# Altium schematic sheet REF_Sensors.SchDoc
size A4; SheetNumber: 8; SheetTotal: 8
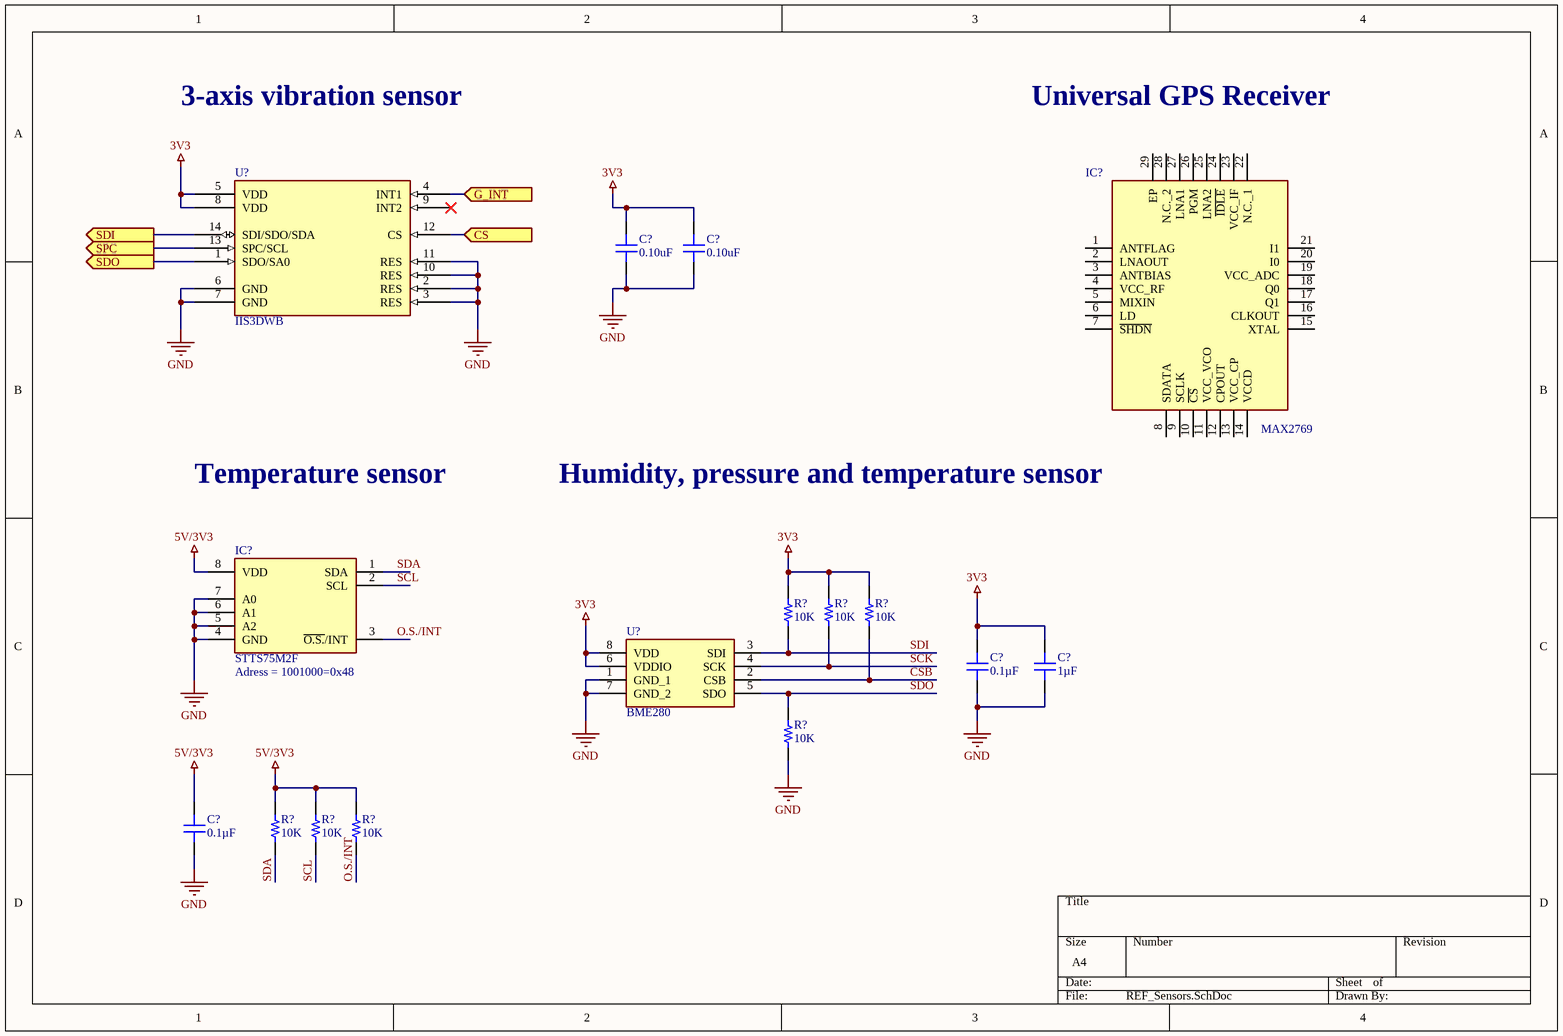
[diagram p0: REF_Sensors.SchDoc]

## Parts
(Parts that share a designator on the sheet are numbered #1, #2 ... from top to bottom, then left to right.)
C?#1  0.10uF  [CAP 0603/1608]
C?#2  0.10uF  [CAP 0603/1608]
C?#3  0.1µF  [CAP 0603_1608]
C?#4  1µF  [CAP 0603_1608]
C?#5  0.1µF  [CAP 0603_1608]
IC?#1  MAX2769  [QFN50P500X500X80-29N]
IC?#2  STTS75M2F  [SOIC127P600X175-8N]
R?#1  10K  [RES 0603/1608]
R?#2  10K  [RES 0603/1608]
R?#3  10K  [RES 0603/1608]
R?#4  10K  [RES 0603/1608]
R?#5  10K  [RES 0603/1608]
R?#6  10K  [RES 0603/1608]
R?#7  10K  [RES 0603/1608]
U?#1  IIS3DWB  [PQFN50P250X300X86-14N]
U?#2  BME280  [BME280]

## Ports
CS (in), G_INT (in), SDI (out), SDO (out), SPC (out)

## Nets
3V3: C?#1.2 C?#2.2 C?#3.1 C?#4.2 R?#1.2 R?#2.2 R?#3.2 U?#1.5(VDD) U?#1.8(VDD) U?#2.6(VDDIO) U?#2.8(VDD)
5V/3V3: C?#5.2 IC?#2.8(VDD) R?#5.2 R?#6.2 R?#7.2
GND: C?#1.1 C?#2.1 C?#3.2 C?#4.1 C?#5.1 IC?#2.4(GND) IC?#2.5(A2) IC?#2.6(A1) IC?#2.7(A0) R?#4.1 U?#1.2(RES) U?#1.3(RES) U?#1.6(GND) U?#1.7(GND) U?#1.10(RES) U?#1.11(RES) U?#2.1(GND_1) U?#2.7(GND_2)
CS: U?#1.12(CS) ; port CS
CSB: R?#3.1 U?#2.2(CSB)
G_INT: U?#1.4(INT1) ; port G_INT
O.S./INT: IC?#2.3(~{O.S.}/INT) R?#7.1
SCK: R?#2.1 U?#2.4(SCK)
SCL: IC?#2.2(SCL) R?#6.1
SDA: IC?#2.1(SDA) R?#5.1
SDI: U?#1.14(SDI/SDO/SDA) ; port SDI
SDI: R?#1.1 U?#2.3(SDI)  [a separate net that carries the same name]
SDO: U?#1.1(SDO/SA0) ; port SDO
SDO: R?#4.2 U?#2.5(SDO)  [a separate net that carries the same name]
SPC: U?#1.13(SPC/SCL) ; port SPC

Not connected (* = marked no-connect by the designer): IC?#1 1(ANTFLAG) 2(LNAOUT) 3(ANTBIAS) 4(VCC_RF) 5(MIXIN) 6(LD) 7(~{SHDN}) 8(SDATA) 9(SCLK) 10(~{CS}) 11(VCC_VCO) 12(CPOUT) 13(VCC_CP) 14(VCCD) 15(XTAL) 16(CLKOUT) 17(Q1) 18(Q0) 19(VCC_ADC) 20(I0) 21(I1) 22(N.C._1) 23(VCC_IF) 24(~{IDLE}) 25(LNA2) 26(PGM) 27(LNA1) 28(N.C._2) 29(EP); U?#1 9(INT2)*

## Notes on the sheet
- 3-axis vibration sensor
- Universal GPS Receiver
- Temperature sensor
- (near IC?#1) Humidity, pressure and temperature sensor
- (near IC?#2) Adress = 1001000=0x48

## Library data of the parts
C?#1 C?#2 = CL10B104KA8NNNC: CAP CER 0.1UF 25V X7R 0603; Manufacturer: Samsung Electro-Mechanics America, Inc.; TemperatureRange: -55C ~ 125C; Tolerance: 10%; Value: 0.10uF; Part Number: CL10B104KA8NNNC; PartId: 13014; Supplier 1: Digi-Key; Supplier Part Number 1: 1276-1006-2-ND; ComponentLink1Description: Datasheet; ComponentLink1URL: http://www.samsungsem.com/kr/support/product-search/mlcc/CL10B104KA8NNNC.jsp; ComponentLink2Description: Digi-Key Listing; ComponentLink2URL: https://www.digikey.com/product-detail/en/samsung-electro-mechanics-america-inc/CL10B104KA8NNNC/1276-1006-2-ND/3886664; TemperatureCoefficient: X7R; Voltage: 25V; Price: 0.0035; Device Package: 0603 (1608 Metric)
C?#3 C?#5 = 06033C104JAT2A: CAP CER 0.1UF 25V X7R 0603; Manufacturer: AVX Corporation; Tolerance: ±5%; Part Number: 06033C104JAT2A; Value: 0.1µF; Applications: General Purpose; Capacitance: 0.1µF; ComponentLink1Description: Datasheet; ComponentLink1URL: http://datasheets.avx.com/X7RDielectric.pdf; ComponentLink2Description: DigiKey Link; ComponentLink2URL: http://digikey.com/product-detail/en/avx-corporation/06033C104JAT2A/478-3713-1-ND/1116411; Device Package: 0603 (1608 Metric); LastUpdated: 9/2/2020 1:03:17 AM; Lifecycle Status: Active; Minimum Order: 1; Mounting Type: Surface Mount, MLCC; Operating Temperature: -55°C ~ 125°C; Package / Case: 0603 (1608 Metric); Packaging: TapeAndReel; PartId: 12698; Part Status: Active; Price: 0.07; Series: -; Size / Dimension: 0.063" L x 0.032" W (1.60mm x 0.81mm); Supplier 1: DigiKey; Supplier Part Number 1: 478-3713-1-ND; Temperature Coefficient: X7R; Thickness (Max): 0.035" (0.90mm); Voltage - Rated: 25V
C?#4 = 06033C105KAT2A: CAP CER 1UF 25V X7R 0603; Manufacturer: AVX Corporation; Tolerance: ±10%; Part Number: 06033C105KAT2A; Value: 1µF; Applications: General Purpose; Capacitance: 1µF; ComponentLink1Description: Datasheet; ComponentLink1URL: http://datasheets.avx.com/X7RDielectric.pdf; ComponentLink2Description: DigiKey Link; ComponentLink2URL: http://digikey.com/product-detail/en/avx-corporation/06033C105KAT2A/478-10046-1-ND/6564269; Device Package: 0603 (1608 Metric); LastUpdated: 9/2/2020 1:03:32 AM; Lifecycle Status: Active; Minimum Order: 1; Mounting Type: Surface Mount, MLCC; Operating Temperature: -55°C ~ 125°C; Package / Case: 0603 (1608 Metric); Packaging: TapeAndReel; PartId: 4115; Part Status: Active; Price: 0.07; Series: -; Size / Dimension: 0.063" L x 0.032" W (1.60mm x 0.81mm); Supplier 1: DigiKey; Supplier Part Number 1: 478-10046-1-ND; Temperature Coefficient: X7R; Thickness (Max): 0.037" (0.94mm); Voltage - Rated: 25V
IC?#1 = MAX2769BETI_V+: IC Unverseal GPS Receiver; Manufacturer_Name: Maxim Integrated; Manufacturer_Part_Number: MAX2769BETI/V+; Datasheet Link: https://pdfserv.maximintegrated.com/en/ds/MAX2769B.pdf; Height: 0.8mm; Mouser Part Number: 700-MAX2769BETI/V+; Mouser Price/Stock: https://www.mouser.com/Search/Refine.aspx?Keyword=700-MAX2769BETI%2FV%2B
IC?#2 = STTS75M2F: IC Temperature sensor; Manufacturer_Name: STMicroelectronics; Datasheet Link: http://www.st.com/st-web-ui/static/active/en/resource/technical/document/datasheet/CD00153513.pdf; Height: 1.75mm; Manufacturer_Part_Number: STTS75M2F; Mouser Part Number: 511-STTS75M2F; Mouser Price/Stock: https://www.mouser.com/Search/Refine.aspx?Keyword=511-STTS75M2F; Arrow Part Number: STTS75M2F; Arrow Price/Stock: https://www.arrow.com/en/products/stts75m2f/stmicroelectronics
R?#1-R?#7 = 0603S8J0103: RES SMD 10K OHM 5% 1/8W 0603; Manufacturer: Uniohm; TemperatureRange: -55C ~ 155C; TemperatureCoefficient: 100ppm/C; PowerRating: 0.125W, 1/8W; Value: 10K; Part Number: 0603S8J0103; Tolerance: 5%; Price: 0.0089; Device Package: 1608 (0603 Metric)
U?#1 = IIS3DWB: 3-axis digital vibration sensor
U?#2 = BME280: MEMS humidity, pressure and temperature sensor